# Altium schematic sheet Summary.SchDoc: Summary
size A4; Author: João Guimarães; Revision: 2.0; SheetNumber: 1; SheetTotal: 9
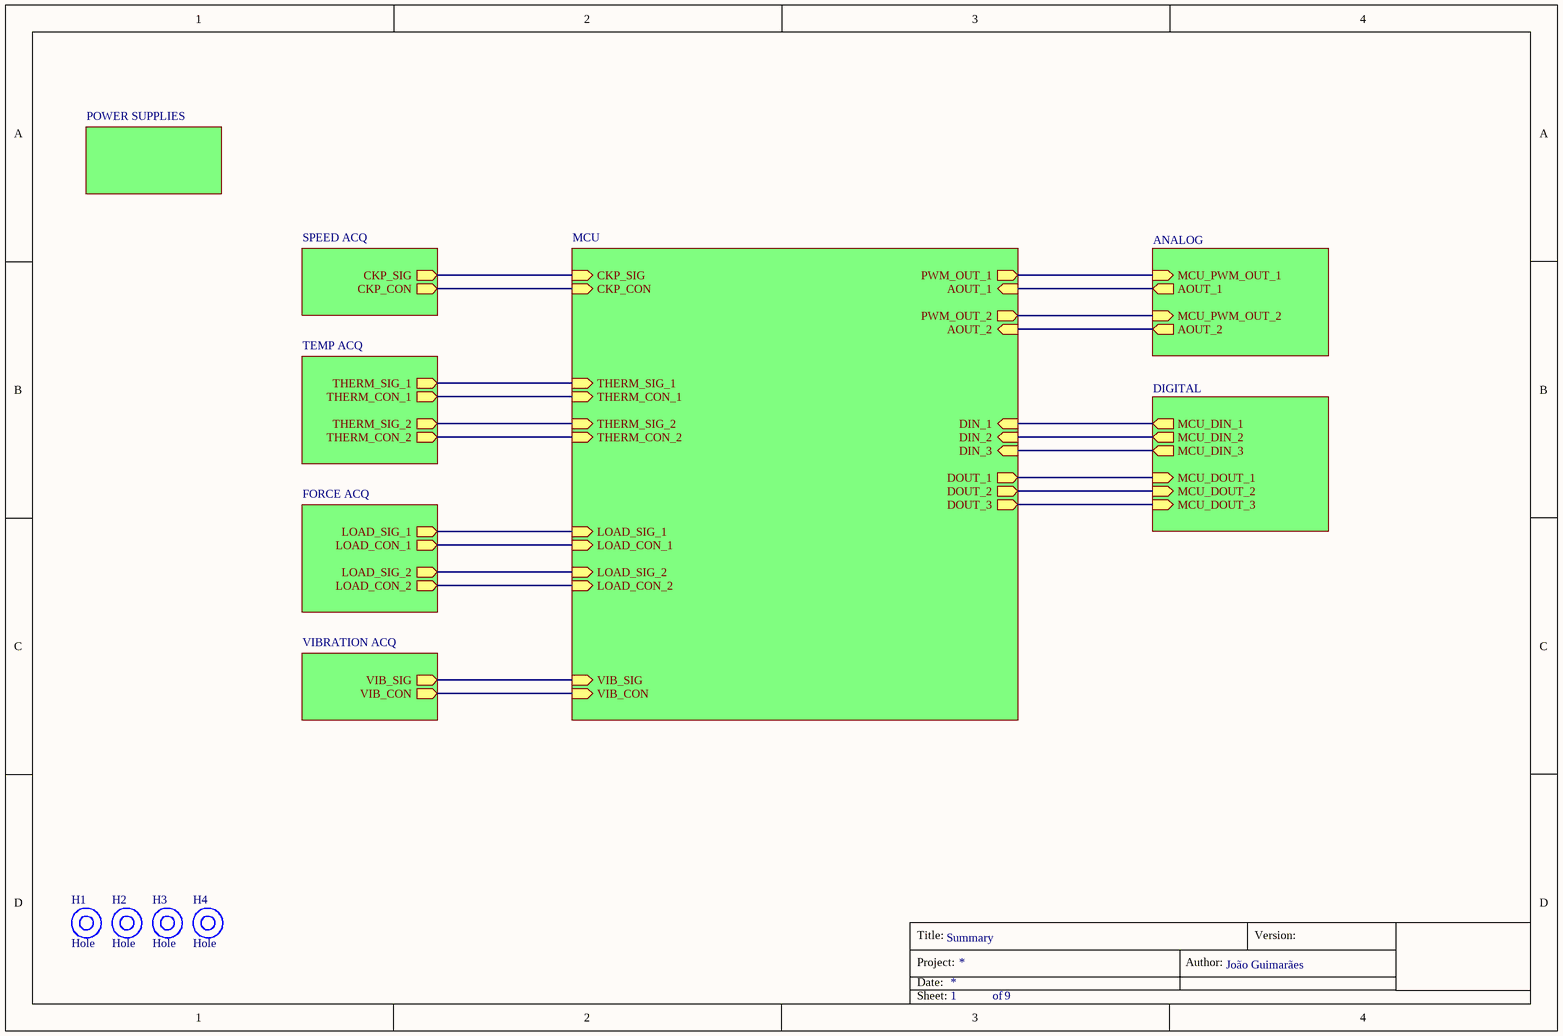
[diagram p0: Summary.SchDoc]

## Parts
H1  Hole  [MISC-HOLE-3.5MM/6.6MM]
H2  Hole  [MISC-HOLE-3.5MM/6.6MM]
H3  Hole  [MISC-HOLE-3.5MM/6.6MM]
H4  Hole  [MISC-HOLE-3.5MM/6.6MM]

## Sub-sheets
ANALOG = AnalogOutput.SchDoc: MCU_PWM_OUT_1 (in), AOUT_1 (out), MCU_PWM_OUT_2 (in), AOUT_2 (out)
DIGITAL = DigitalInterfaces.SchDoc: MCU_DIN_1 (out), MCU_DIN_2 (out), MCU_DIN_3 (out), MCU_DOUT_1 (in), MCU_DOUT_2 (in), MCU_DOUT_3 (in)
FORCE ACQ = ForceACQ.SchDoc: LOAD_SIG_1 (out), LOAD_CON_1 (out), LOAD_SIG_2 (out), LOAD_CON_2 (out)
MCU = MCU.SchDoc: CKP_SIG (in), CKP_CON (in), THERM_SIG_1 (in), THERM_CON_1 (in), THERM_SIG_2 (in), THERM_CON_2 (in), LOAD_SIG_1 (in), LOAD_CON_1 (in), LOAD_SIG_2 (in), LOAD_CON_2 (in), VIB_SIG (in), VIB_CON (in), DIN_1 (in), DIN_2 (in), DIN_3 (in), DOUT_1 (out), DOUT_2 (out), DOUT_3 (out), PWM_OUT_1 (out), AOUT_1 (in), AOUT_2 (in), PWM_OUT_2 (out)
POWER SUPPLIES = PowerSupplies.SchDoc: no entries
SPEED ACQ = SpeedACQ.SchDoc: CKP_SIG (out), CKP_CON (out)
TEMP ACQ = TemperatureACQ.SchDoc: THERM_SIG_1 (out), THERM_CON_1 (out), THERM_SIG_2 (out), THERM_CON_2 (out)
VIBRATION ACQ = VibrationACQ.SchDoc: VIB_SIG (out), VIB_CON (out)

## Nets
(unnamed): sheet SPEED ACQ/CKP_SIG, sheet MCU/CKP_SIG
(unnamed): sheet SPEED ACQ/CKP_CON, sheet MCU/CKP_CON
(unnamed): sheet MCU/THERM_SIG_1, sheet TEMP ACQ/THERM_SIG_1
(unnamed): sheet MCU/THERM_CON_1, sheet TEMP ACQ/THERM_CON_1
(unnamed): sheet MCU/THERM_SIG_2, sheet TEMP ACQ/THERM_SIG_2
(unnamed): sheet MCU/THERM_CON_2, sheet TEMP ACQ/THERM_CON_2
(unnamed): sheet MCU/LOAD_SIG_1, sheet FORCE ACQ/LOAD_SIG_1
(unnamed): sheet MCU/LOAD_CON_1, sheet FORCE ACQ/LOAD_CON_1
(unnamed): sheet MCU/LOAD_SIG_2, sheet FORCE ACQ/LOAD_SIG_2
(unnamed): sheet MCU/LOAD_CON_2, sheet FORCE ACQ/LOAD_CON_2
(unnamed): sheet MCU/VIB_SIG, sheet VIBRATION ACQ/VIB_SIG
(unnamed): sheet MCU/VIB_CON, sheet VIBRATION ACQ/VIB_CON
(unnamed): sheet MCU/DIN_1, sheet DIGITAL/MCU_DIN_1
(unnamed): sheet MCU/DIN_2, sheet DIGITAL/MCU_DIN_2
(unnamed): sheet MCU/DIN_3, sheet DIGITAL/MCU_DIN_3
(unnamed): sheet MCU/DOUT_1, sheet DIGITAL/MCU_DOUT_1
(unnamed): sheet MCU/DOUT_2, sheet DIGITAL/MCU_DOUT_2
(unnamed): sheet MCU/DOUT_3, sheet DIGITAL/MCU_DOUT_3
(unnamed): sheet MCU/PWM_OUT_1, sheet ANALOG/MCU_PWM_OUT_1
(unnamed): sheet MCU/AOUT_1, sheet ANALOG/AOUT_1
(unnamed): sheet MCU/AOUT_2, sheet ANALOG/AOUT_2
(unnamed): sheet MCU/PWM_OUT_2, sheet ANALOG/MCU_PWM_OUT_2

## Notes on the sheet
- Title:
- Project:
- Date:
- Author:
- Version:
- Sheet:
- of